# EasyEDA schematic Sheet_1.json
TITLE: Sheet_1; REV: 1.0; Date: 2026-03-09; Sheet: 1/1; Drawn By: Sandun Siwantha; Company: Your Company
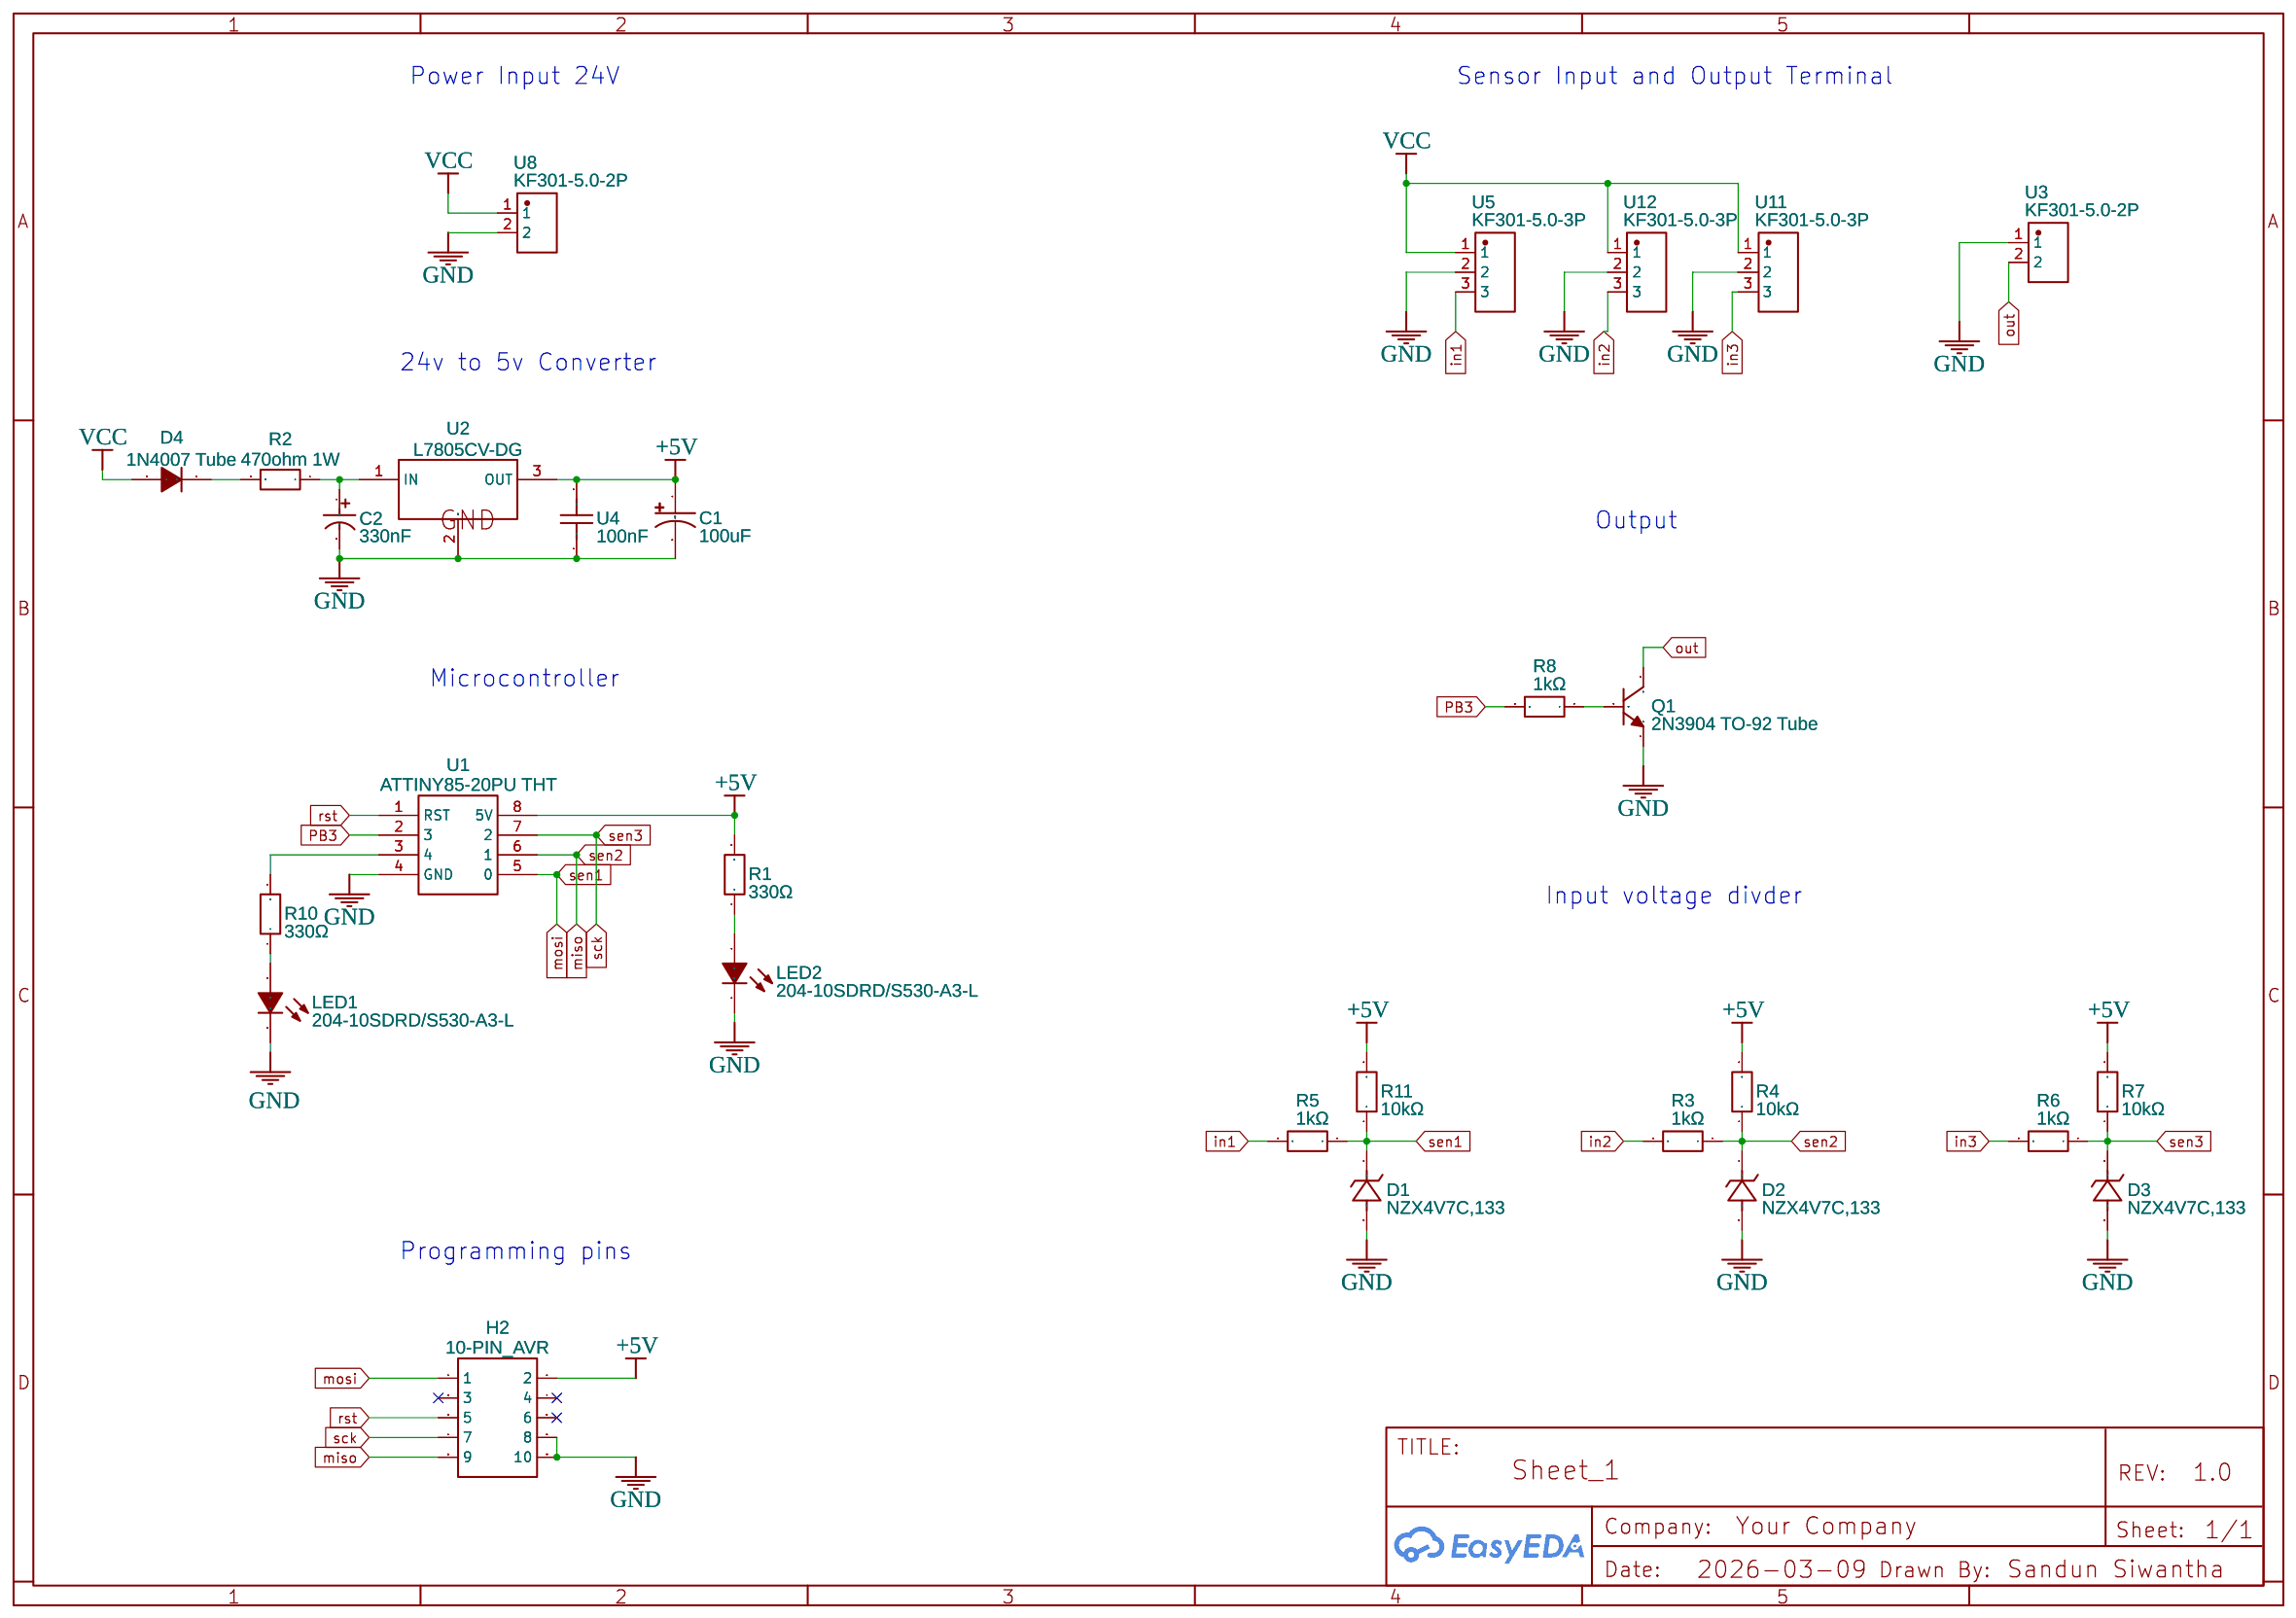
[diagram p0: schematic sheet]

## Parts
C1  100uF  [CAP-TH_BD6.3-P2.50-D1.0-FD]
C2  330nF  [CAP-TH_BD5.0-P2.00-D0.8-FD]
D1  NZX4V7C,133  [SOD-27_BD1.9-L4.3-P8.25-D0.6-RD]
D2  NZX4V7C,133  [SOD-27_BD1.9-L4.3-P8.25-D0.6-RD]
D3  NZX4V7C,133  [SOD-27_BD1.9-L4.3-P8.25-D0.6-RD]
D4  1N4007 Tube  [DO-41_BD2.4-L4.7-P8.70-D0.9-RD]
H2  10-PIN_AVR  [HDR-TH_10P-P2.54-V-M-R2-C5-S2.54]
LED1  204-10SDRD/S530-A3-L  [LED-TH_BD3.8-P2.54-FD]
LED2  204-10SDRD/S530-A3-L  [LED-TH_BD3.8-P2.54-FD]
Q1  2N3904 TO-92 Tube  [TO-92-3_L4.9-W3.7-P2.54-L]
R1  330Ω  [RES-TH_BD2.7-L6.2-P10.20-D0.4]
R2  470ohm 1W  [RES-TH_BD2.7-L6.2-P10.20-D0.4]
R3  1kΩ  [RES-TH_BD2.7-L6.2-P10.20-D0.4]
R4  10kΩ  [RES-TH_BD2.7-L6.2-P10.20-D0.4]
R5  1kΩ  [RES-TH_BD2.7-L6.2-P10.20-D0.4]
R6  1kΩ  [RES-TH_BD2.7-L6.2-P10.20-D0.4]
R7  10kΩ  [RES-TH_BD2.7-L6.2-P10.20-D0.4]
R8  1kΩ  [RES-TH_BD2.7-L6.2-P10.20-D0.4]
R10  330Ω  [RES-TH_BD2.7-L6.2-P10.20-D0.4]
R11  10kΩ  [RES-TH_BD2.7-L6.2-P10.20-D0.4]
U1  ATTINY85-20PU THT  [ATTINY85]
U2  L7805CV-DG  [TO-220-3_L10.0-W4.5-P2.54-L]
U3  KF301-5.0-2P  [CONN-TH_P5.00_KF301-5.0-2P]
U4  100nF  [CAP-TH_L5.8-W2.8]
U5  KF301-5.0-3P  [CONN-TH_3P-P5.00_KF301-5.0-3P]
U8  KF301-5.0-2P  [CONN-TH_P5.00_KF301-5.0-2P]
U11  KF301-5.0-3P  [CONN-TH_3P-P5.00_KF301-5.0-3P]
U12  KF301-5.0-3P  [CONN-TH_3P-P5.00_KF301-5.0-3P]

## Library data of the parts
C1 = NXA 35V100uF: Contributor: LCSC; Supplier: LCSC; Supplier Part: C165537; Manufacturer: SAMYOUNG(韩国三莹); Manufacturer Part: NXA 35V100M 6.3*11; JLCPCB Part Class: Extended Part
C2 = 0.33uF 50V 5*11: Supplier: LCSC; Manufacturer: Chengx(承兴); Manufacturer Part: KM334M050D11RR0VH2FP0; Supplier Part: C45097; JLCPCB Part Class: Extended Part
D1-D3 = NZX4V7C,133: Contributor: LCSC; Supplier: LCSC; Supplier Part: C551726; Manufacturer: Nexperia(安世); JLCPCB Part Class: Extended Part
D4 = 1N4007 Tube: Supplier: LCSC; Manufacturer: MDD(辰达半导体); Manufacturer Part: 1N4007 编带; Supplier Part: C19357; JLCPCB Part Class: Extended Part
H2 = Header-Male-2.54_2x5: Supplier: LCSC; Manufacturer Part: 2*5p排针 2.54mm; Supplier Part: C28207; JLCPCB Part Class: Extended Part; Manufacturer: null
LED1 LED2 = 204-10SDRD/S530-A3-L: Supplier: LCSC; Manufacturer: EVERLIGHT(亿光); Supplier Part: C84774; JLCPCB Part Class: Extended Part
Q1 = 2N3904 TO-92 Tube: Supplier: LCSC; Manufacturer: CJ(江苏长电/长晶); Manufacturer Part: 2N3904-TA(RANGE:200-300); Supplier Part: C2081; JLCPCB Part Class: Extended Part
R1-R8 R10 R11 = CR1/4W-330Ω±5%-ST52: Contributor: lcsc; Supplier: LCSC; Supplier Part: C2894690; Manufacturer: VO(翔胜); JLCPCB Part Class: Extended Part
U1 = ATTINY85-20PU THT: Manufacturer Part: ATTINY85-20PU; Supplier Part: 1455162; Supplier: Element14; link: http://au.element14.com/atmel/attiny85-20pu/mcu-8bit-attiny-20mhz-dip-8/dp/1455162; Contributor: AutogolazzoJr
U2 = L7805CV-DG: Supplier: LCSC; Manufacturer: ST(意法半导体); Supplier Part: C3795; JLCPCB Part Class: Extended Part
U3 U8 = KF301-5.0-2P: Contributor: LCSC; Supplier: LCSC; Supplier Part: C474881; Manufacturer: KEFA(科发); JLCPCB Part Class: Extended Part
U4 = CC1H104MC1FD3F6C10SA: Contributor: lcsc; Supplier: LCSC; Supplier Part: C5375966; Manufacturer: Dersonic(德尔创); JLCPCB Part Class: Extended Part
U5 U11 U12 = KF301-5.0-3P: Contributor: LCSC; Supplier: LCSC; Supplier Part: C474882; Manufacturer: KEFA(科发); JLCPCB Part Class: Extended Part

## Nets
+5V: C1.1 H2.2 R1.2 R4.2 R7.2 R11.2 U1.8(5V) U2.3(OUT) U4.2
GND: C1.2 C2.2 D1.2(A) D2.2(A) D3.2(A) H2.8 H2.10 LED1.2(C) LED2.2(C) Q1.1(E) U1.4(GND) U2.2(GND) U3.1 U4.1 U5.2 U8.2 U11.2 U12.2
VCC: D4.2(A) U5.1 U8.1 U11.1 U12.1
in1: R5.2 U5.3
in2: R3.2 U12.3
in3: R6.2 U11.3
miso: D2.1(K) H2.9 R3.1 R4.1 U1.6(1)
mosi: D1.1(K) H2.1 R5.1 R11.1 U1.5(0)
out: Q1.3(C) U3.2
PB3: R8.2 U1.2(3)
rst: H2.5 U1.1(RST)
sck: D3.1(K) H2.7 R6.1 R7.1 U1.7(2)
Net-(C2-1): C2.1 R2.1 U2.1(IN)
Net-(D4-1): D4.1(K) R2.2
Net-(LED1-1): LED1.1(A) R10.1
Net-(LED2-1): LED2.1(A) R1.1
Net-(Q1-2): Q1.2(B) R8.1
Net-(R10-2): R10.2 U1.3(4)

Not connected (* = marked no-connect by the designer): H2 3* 4* 6*

## Notes on the sheet
- Power Input 24V
- Sensor Input and Output Terminal
- 24v to 5v Converter
- Output
- Microcontroller
- Input voltage divder
- Programming pins
